# Altium schematic sheet Micro.SchDoc: Sample Sheet Title
size B; Date: MM/DD/YYYY; Author: Sample Author; Organization: ORGANIZATION; Address1: ADDRESS 1; Address2: ADDRESS 2; Address3: ADDRESS 3; Address4: ADDRESS 4; Revision: -; SheetNumber: 1; SheetTotal: 2; ENG_APP_DATE: --/--/--; DSN_APP_DATE: --/--/--; CHK_APP_DATE: --/--/--
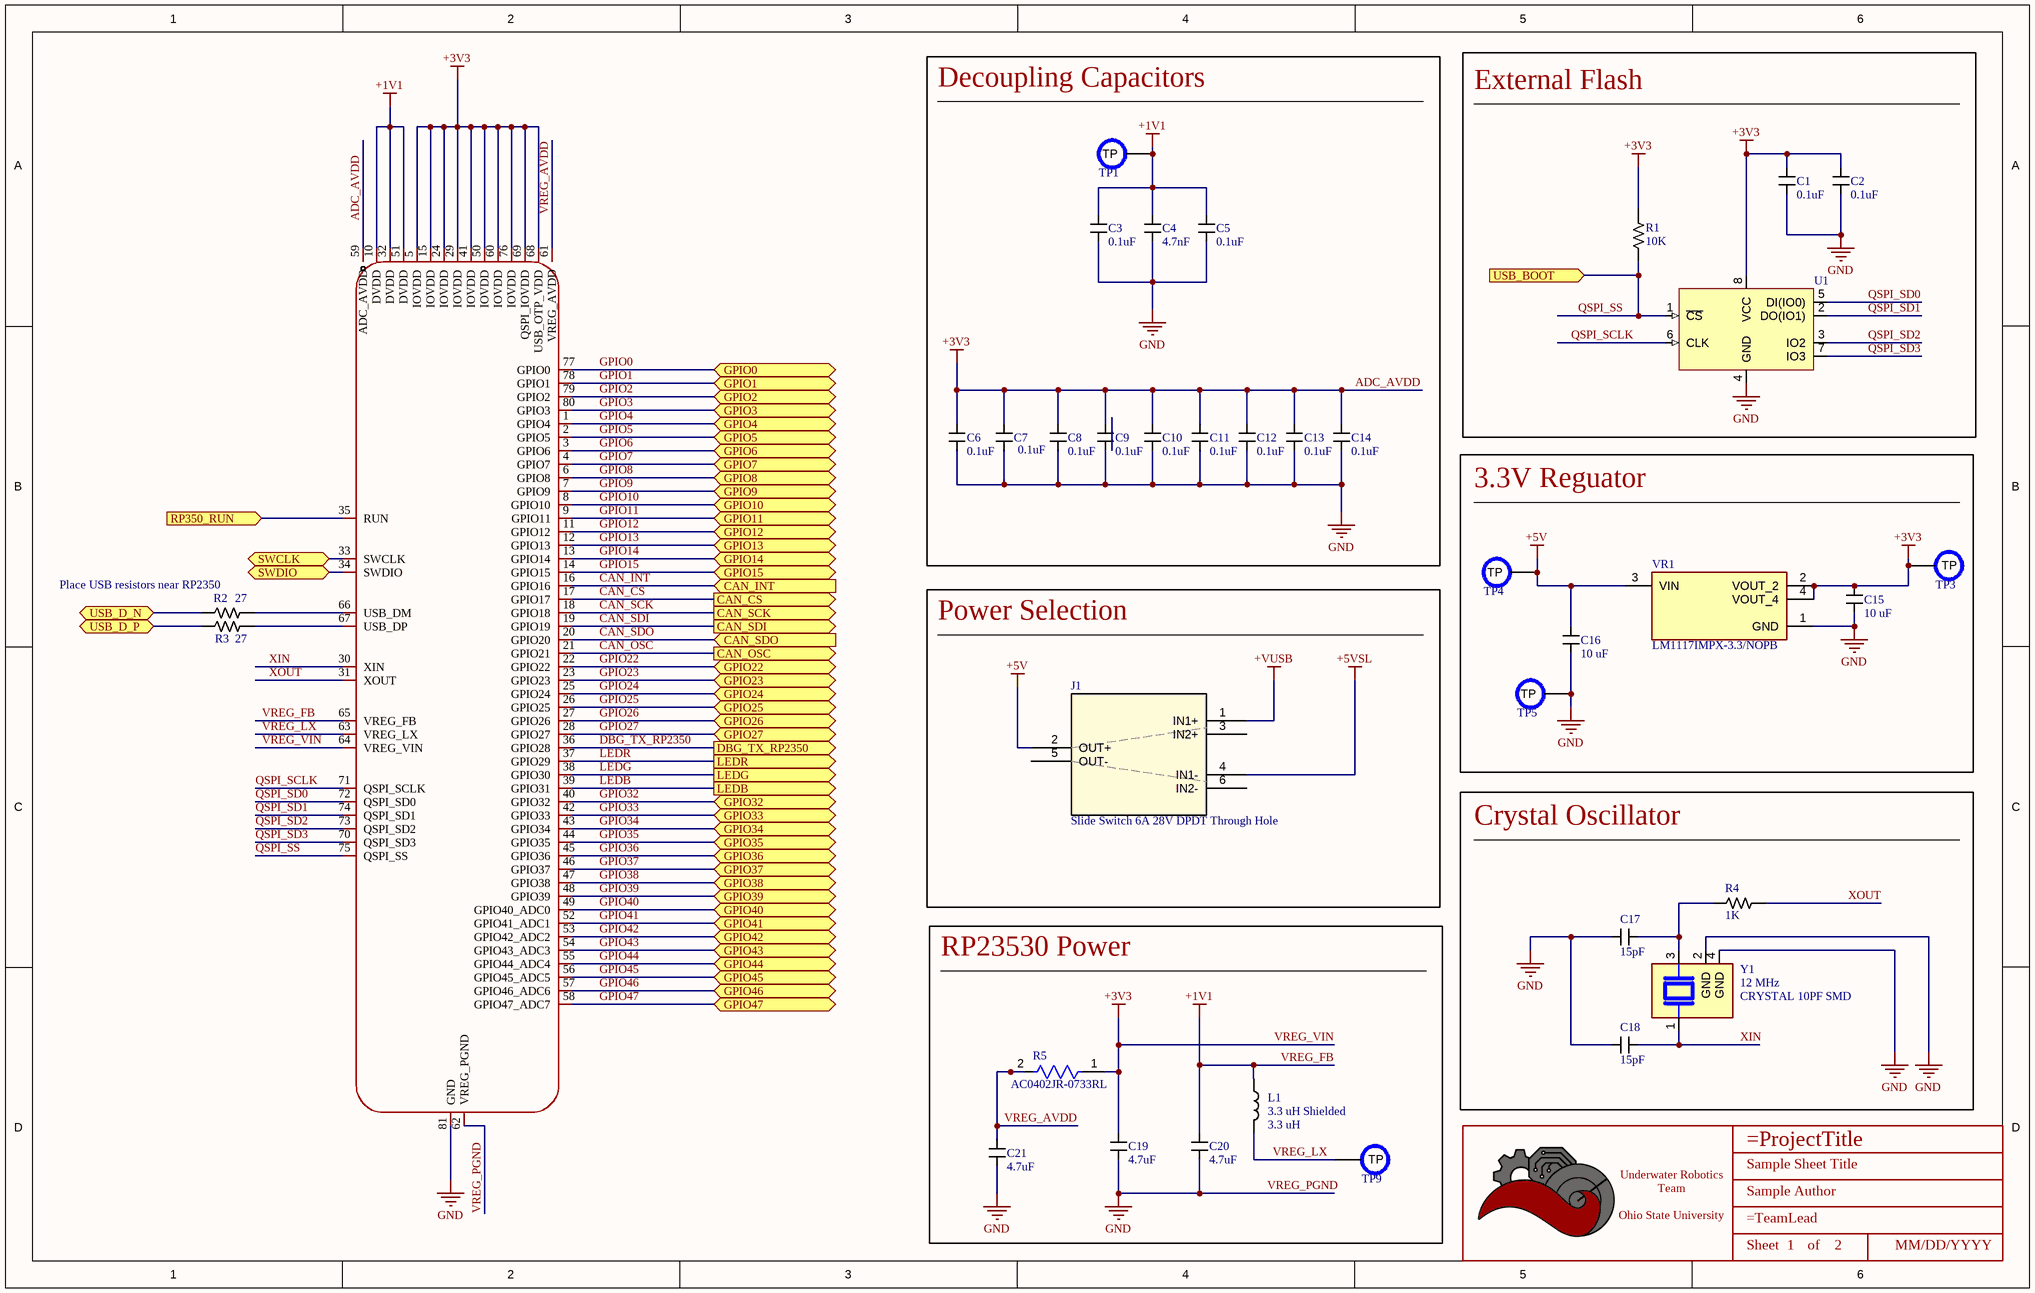
[diagram p0: Micro.SchDoc]

## Parts
*  Title_Block  [LOGO]  (value not drawn)  (graphical)
C1  value 0.1uF  [CAPACITOR_0402]  (hidden comment: 100nF Ceramic 25V)
C2  value 0.1uF  [CAPACITOR_0402]  (hidden comment: 100nF Ceramic 25V)
C3  value 0.1uF  [CAPACITOR_0402]  (hidden comment: 100nF Ceramic 25V)
C4  value 4.7nF  [CAPACITOR_0402]  (hidden comment: 4700pF Ceramic 25V)
C5  value 0.1uF  [CAPACITOR_0402]  (hidden comment: 100nF Ceramic 25V)
C6  value 0.1uF  [CAPACITOR_0402]  (hidden comment: 100nF Ceramic 25V)
C7  value 0.1uF  [CAPACITOR_0402]  (hidden comment: 100nF Ceramic 25V)
C8  value 0.1uF  [CAPACITOR_0402]  (hidden comment: 100nF Ceramic 25V)
C9  value 0.1uF  [CAPACITOR_0402]  (hidden comment: 100nF Ceramic 25V)
C10  value 0.1uF  [CAPACITOR_0402]  (hidden comment: 100nF Ceramic 25V)
C11  value 0.1uF  [CAPACITOR_0402]  (hidden comment: 100nF Ceramic 25V)
C12  value 0.1uF  [CAPACITOR_0402]  (hidden comment: 100nF Ceramic 25V)
C13  value 0.1uF  [CAPACITOR_0402]  (hidden comment: 100nF Ceramic 25V)
C14  value 0.1uF  [CAPACITOR_0402]  (hidden comment: 100nF Ceramic 25V)
C15  Value (uF): 10 uF  [CAPACITOR_0603]  (hidden comment: 10uF Ceramic 6.3V)
C16  Value (uF): 10 uF  [CAPACITOR_0603]  (hidden comment: 10uF Ceramic 6.3V)
C17  value 15pF  [CAPACITOR_0402]  (hidden comment: 15pF Ceramic 50V)
C18  value 15pF  [CAPACITOR_0402]  (hidden comment: 15pF Ceramic 50V)
C19  value 4.7uF  [CAPACITOR_0603]  (hidden comment: 4.7uF Ceramic 6.3V)
C20  value 4.7uF  [CAPACITOR_0603]  (hidden comment: 4.7uF Ceramic 6.3V)
C21  value 4.7uF  [CAPACITOR_0603]  (hidden comment: 4.7uF Ceramic 6.3V)
J1  Slide Switch 6A 28V DPDT Through Hole  [CONN_S3CQE2]
L1  3.3 uH Shielded  value 3.3 uH  [INDUCTOR_0806]
R1  Value  (Ohms): 10K  [RESISTOR_0603]  (hidden comment: 10k Ohm 0.5% 1/10W)
R2  Value  (Ohms): 27  [RESISTOR_0402]  (hidden comment: 27 Ohm 1% 1/16W)
R3  Value  (Ohms): 27  [RESISTOR_0402]  (hidden comment: 27 Ohm 1% 1/16W)
R4  Value  (Ohms): 1K  [RESISTOR_0402]  (hidden comment: 1k Ohm 1% 1/16W)
R5  AC0402JR-0733RL  [FP-AC0402-IPC_C]
TP1  PCB Test Point  [TESTPOINT_1.2MM]  (value not drawn)  (no BOM)
TP3  PCB Test Point  [TESTPOINT_1.2MM]  (value not drawn)  (no BOM)
TP4  PCB Test Point  [TESTPOINT_1.2MM]  (value not drawn)  (no BOM)
TP5  PCB Test Point  [TESTPOINT_1.2MM]  (value not drawn)  (no BOM)
TP9  PCB Test Point  [TESTPOINT_1.2MM]  (value not drawn)  (no BOM)
U1  W25Q128JVSIQ  [SOIC-8 W25QxJV]  (value not drawn)
U2  RP2350B  [QFN-80]  (value not drawn)
VR1  LM1117IMPX-3.3/NOPB  [SOT-223-4]
Y1  CRYSTAL 10PF SMD  value 12 MHz  [4-SMD, NO LEAD CRYSTAL 3.2x2.5mm]

## Blocks framed on the sheet
Decoupling Capacitors: C3-C14 TP1
External Flash: C1 C2 R1 U1
3.3V Reguator: C15 C16 TP3-TP5 VR1
Power Selection: J1
Crystal Oscillator: C17 C18 R4 Y1
RP23530 Power: C19-C21 L1 R5 TP9

## Ports
CAN_CS (out), CAN_INT (in), CAN_OSC (out), CAN_SCK (out), CAN_SDI (out), CAN_SDO (in), DBG_TX_RP2350 (out), GPIO0 (bidir), GPIO1 (bidir), GPIO2 (bidir), GPIO3 (bidir), GPIO4 (bidir), GPIO5 (bidir), GPIO6 (bidir), GPIO7 (bidir), GPIO8 (bidir), GPIO9 (bidir), GPIO10 (bidir), GPIO11 (bidir), GPIO12 (bidir), GPIO13 (bidir), GPIO14 (bidir), GPIO15 (bidir), GPIO22 (bidir), GPIO23 (bidir), GPIO24 (bidir), GPIO25 (bidir), GPIO26 (bidir), GPIO27 (bidir), GPIO32 (bidir), GPIO33 (bidir), GPIO34 (bidir), GPIO35 (bidir), GPIO36 (bidir), GPIO37 (bidir), GPIO38 (bidir), GPIO39 (bidir), GPIO40 (bidir), GPIO41 (bidir), GPIO42 (bidir), GPIO43 (bidir), GPIO44 (bidir), GPIO45 (bidir), GPIO46 (bidir), GPIO47 (bidir), LEDB (out), LEDG (out), LEDR (out), RP350_RUN (in), SWCLK (bidir), SWDIO (bidir), USB_BOOT (in), USB_D_N (bidir), USB_D_P (bidir)

## Nets
+5V: C16.1 J1.2(OUT+) TP4.TP VR1.3(VIN)
+5VSL: J1.4(IN1-)
+VUSB: J1.1(IN1+)
ADC_AVDD: C1.1 C2.1 C6.1 C7.1 C8.1 C9.1 C10.1 C11.1 C12.1 C13.1 C14.1 C15.1 C19.1 R1.1 R5.1 TP3.TP U1.8(VCC) U2.5(IOVDD) U2.15(IOVDD) U2.24(IOVDD) U2.29(IOVDD) U2.41(IOVDD) U2.50(IOVDD) U2.59(ADC_AVDD) U2.60(IOVDD) U2.64(VREG_VIN) U2.68(USB_OTP_VDD) U2.69(QSPI_IOVDD) U2.76(IOVDD) VR1.2(VOUT_2) VR1.4(VOUT_4)  [also labelled +3V3, VREG_VIN]
VREG_FB: C3.1 C4.1 C5.1 C20.2 L1.2 TP1.TP U2.10(DVDD) U2.32(DVDD) U2.51(DVDD) U2.65(VREG_FB)  [also labelled +1V1]
VREG_PGND: C1.2 C2.2 C3.2 C4.2 C5.2 C6.2 C7.2 C8.2 C9.2 C10.2 C11.2 C12.2 C13.2 C14.2 C15.2 C16.2 C17.2 C18.2 C19.2 C20.1 C21.2 TP5.TP U1.4(GND) U2.62(VREG_PGND) U2.81(GND) VR1.1(GND) Y1.2(GND) Y1.4(GND)  [also labelled GND]
CAN_CS: U2.17(GPIO17) ; port CAN_CS
CAN_INT: U2.16(GPIO16) ; port CAN_INT
CAN_OSC: U2.21(GPIO21) ; port CAN_OSC
CAN_SCK: U2.18(GPIO18) ; port CAN_SCK
CAN_SDI: U2.19(GPIO19) ; port CAN_SDI
CAN_SDO: U2.20(GPIO20) ; port CAN_SDO
DBG_TX_RP2350: U2.36(GPIO28) ; port DBG_TX_RP2350
GPIO0: U2.77(GPIO0) ; port GPIO0
GPIO1: U2.78(GPIO1) ; port GPIO1
GPIO2: U2.79(GPIO2) ; port GPIO2
GPIO3: U2.80(GPIO3) ; port GPIO3
GPIO4: U2.1(GPIO4) ; port GPIO4
GPIO5: U2.2(GPIO5) ; port GPIO5
GPIO6: U2.3(GPIO6) ; port GPIO6
GPIO7: U2.4(GPIO7) ; port GPIO7
GPIO8: U2.6(GPIO8) ; port GPIO8
GPIO9: U2.7(GPIO9) ; port GPIO9
GPIO10: U2.8(GPIO10) ; port GPIO10
GPIO11: U2.9(GPIO11) ; port GPIO11
GPIO12: U2.11(GPIO12) ; port GPIO12
GPIO13: U2.12(GPIO13) ; port GPIO13
GPIO14: U2.13(GPIO14) ; port GPIO14
GPIO15: U2.14(GPIO15) ; port GPIO15
GPIO22: U2.22(GPIO22) ; port GPIO22
GPIO23: U2.23(GPIO23) ; port GPIO23
GPIO24: U2.25(GPIO24) ; port GPIO24
GPIO25: U2.26(GPIO25) ; port GPIO25
GPIO26: U2.27(GPIO26) ; port GPIO26
GPIO27: U2.28(GPIO27) ; port GPIO27
GPIO32: U2.40(GPIO32) ; port GPIO32
GPIO33: U2.42(GPIO33) ; port GPIO33
GPIO34: U2.43(GPIO34) ; port GPIO34
GPIO35: U2.44(GPIO35) ; port GPIO35
GPIO36: U2.45(GPIO36) ; port GPIO36
GPIO37: U2.46(GPIO37) ; port GPIO37
GPIO38: U2.47(GPIO38) ; port GPIO38
GPIO39: U2.48(GPIO39) ; port GPIO39
GPIO40: U2.49(GPIO40_ADC0) ; port GPIO40
GPIO41: U2.52(GPIO41_ADC1) ; port GPIO41
GPIO42: U2.53(GPIO42_ADC2) ; port GPIO42
GPIO43: U2.54(GPIO43_ADC3) ; port GPIO43
GPIO44: U2.55(GPIO44_ADC4) ; port GPIO44
GPIO45: U2.56(GPIO45_ADC5) ; port GPIO45
GPIO46: U2.57(GPIO46_ADC6) ; port GPIO46
GPIO47: U2.58(GPIO47_ADC7) ; port GPIO47
LEDB: U2.39(GPIO31) ; port LEDB
LEDG: U2.38(GPIO30) ; port LEDG
LEDR: U2.37(GPIO29) ; port LEDR
QSPI_SCLK: U1.6(CLK) U2.71(QSPI_SCLK)
QSPI_SD0: U1.5(DI(IO0)) U2.72(QSPI_SD0)
QSPI_SD1: U1.2(DO(IO1)) U2.74(QSPI_SD1)
QSPI_SD2: U1.3(IO2) U2.73(QSPI_SD2)
QSPI_SD3: U1.7(IO3) U2.70(QSPI_SD3)
QSPI_SS: R1.2 U1.1(~{CS}) U2.75(QSPI_SS) ; port USB_BOOT
RP350_RUN: U2.35(RUN) ; port RP350_RUN
SWCLK: U2.33(SWCLK) ; port SWCLK
SWDIO: U2.34(SWDIO) ; port SWDIO
USB_D_N: R2.2 ; port USB_D_N
USB_D_P: R3.2 ; port USB_D_P
VREG_AVDD: C21.1 R5.2 U2.61(VREG_AVDD)
VREG_LX: L1.1 TP9.TP U2.63(VREG_LX)
XIN: C18.1 U2.30(XIN) Y1.1
XOUT: R4.1 U2.31(XOUT)
NetC17_1: C17.1 R4.2 Y1.3
NetR2_1: R2.1 U2.66(USB_DM)
NetR3_1: R3.1 U2.67(USB_DP)

Not connected (* = marked no-connect by the designer): J1 3(IN2+) 5(OUT-) 6(IN2-)

## Notes on the sheet
- Place USB resistors near RP2350
- Labels drawn without touching a wire or pin: \
- DWG. NO.
- REV.
- SHT.
- THIS DOCUMENT AND THE DATA DISCLOSED HEREIN OR HEREWITH IS THE PROPERTY OF ALTIUM LIMITED AND MAY BE FREELY DISTRIBUTED IN WHOLE. NO RIGHTS ARE RESERVED OR EXPRESS OR IMPLIED WARANTEE GIVEN.
- REVISION
- DESCRIPTION
- DATE
- APPROVED
- ENG:
- APPROVALS
- PROJECT
- DSN:
- CHK:
- REFERENCE DOCUMENTS
- PROJECT REVISION:
- TITLE
- DOCUMENT REVISION:
- DESIGN ITEM:
- BOM:
- FAB DWG:
- PCB DWG:
- ASSY DWG:
- SCALE:
- SIZE
- B
- CAGE CODE
- FILE NAME
- DWG NO.
- SHEET
- OF
- REV
- (in symbol Title_Block) Underwater Robotics Team / Ohio State University; Sheet; of

## Library data of the parts
* = Title_Block: UWRT Schematic Title Block Template / Created June 2021, Dylan Trainor
C1-C3 C5-C14 = CAPACITOR_0.1uF_0402: Cap 100nF 25V +/-10% / Ceramic 0402; Made By: Robert Pafford; Tolerance: +/- 10%; Voltage: 25V; Supplier 1: Future Electronics; Supplier Part Number 1: 7029569
C4 = CAPACITOR_0.0047uF_0402: 4700 pF +/-10% 25V Ceramic Capacitor X7R 0402; Made By: Robert Pafford; Tolerance: +/- 10%; Voltage: 25V; Supplier 1: Future Electronics; Supplier Part Number 1: 1909415
C15 C16 = CAPACITOR_10uF_0603: Cap 10uF 6.3V +/-20% / Ceramic 0603; Made By: Flip B; ComponentLink1Description: Digikey; ComponentLink1URL: https://www.digikey.com/en/products/detail/samsung-electro-mechanics/CL10A106MQ8NNNC/3886777; Supplier 1: Digi-Key; Supplier Part Number 1: 1276-1119-1-ND; Tolerance: +/- 20%; Voltage: 6.3V
C17 C18 = CAPACITOR_0.000015uF_0402: CAP CER 15PF 50V C0G/NP0 0402; Tolerance: +/- 5%; Made By: Robert Pafford; Voltage: 50V; Supplier 1: Newark; Supplier Part Number 1: 82AC9245
C19-C21 = CAPACITOR_4.7uF_0603: Cap 4.7uF 6.3V +/-10% / Ceramic 0603; Made By: Robert Pafford; Tolerance: +/- 10%; Voltage: 6.3V; Supplier 1: Digi-Key; Supplier Part Number 1: 1276-2087-1-ND
J1 = Slide DPDT Switch: SWITCH SLIDE DPDT 6A 28V Through Hole; Mfr_Name: C&K; Manufacturer_Part_Number: 1201M2S3CQE2; Copyright: Copyright (C) 2022 Ultra Librarian. All rights reserved.; RefDes: RefDes; Type: DEV; Supplier 1: Newark; Supplier Part Number 1: 36AH1005
L1 = INDUCTOR_3.3uH_0806: 3.3 µH Shielded Molded Inductor 2.1 A 140mOhm Max 0806 (2016 Metric); Manufacturer: Abracon LLC; Supplier 1: DigiKey; Supplier Part Number 1: 535-AOTA-B201610S3R3-101-TDKR-ND; Created By: John Ulm
R1 = RESISTOR_10K_0.5%_0603: RES 10k OHM 0.5% 1/10W 0603; Tolerance: +/- 0.5%; Made By: Robert Pafford; Wattage: 1/10W; Supplier: Digikey; Digikey Part Numer: CR0603-JW-104ELFTR-ND; Supplier 1: Digi-Key; Supplier Part Number 1: 749-1695-1-ND
R2 R3 = RESISTOR_27_0402: RES 27 OHM 1% 1/16W 0402; Tolerance: +/- 1%; Made By: Robert Pafford; Wattage: 1/16W; Supplier: Digikey; Digikey Part Numer: CR0603-JW-104ELFTR-ND; Supplier 1: Digi-Key; Supplier Part Number 1: YAG5278DKR-ND
R4 = RESISTOR_1K_0402: RES 1k OHM 1% 1/16W 0402; Tolerance: +/- 1%; Made By: Robert Pafford; Wattage: 1/16W; Supplier: Digikey; Digikey Part Numer: CR0603-JW-104ELFTR-ND; Supplier 1: Digi-Key; Supplier Part Number 1: 13-AC0402FR-131KLCT-ND
R5 = CMP-03412-045460-1: RES 33Ω ±5% 0.063W 0402; Resistance: 33R; Voltage Rating: 50V; Power Rating: 62.5mW; Temperature Coefficient: 100ppm/°C; Max Power Dissipation: 63mW; Width: 0.5mm; Max Operating Temperature: 155°C; Termination: SMD/SMT; Size Code: 0402; Lead Free: Lead Free; Series: AC; Case Code (Imperial): 0402; RoHS Compliant: Yes; Packaging: Tape and Reel; Features: Moisture Resistant; Case/Package: 0402; Height: 0.015inch; Length: 0.039inch; Number of Terminations: 2; Case Code (Metric): 1005; Tolerance: 5%; Min Operating Temperature: -55°C; Weight: 2.3E-05oz; Resistor Type: Thick Film
TP1 TP3-TP5 TP9 = TESTPOINT: Made By: Robert Pafford
U1 = W25Q128JVSIQ: IC FLASH 128MBIT SPI/QUAD 8SOIC; Made By: Robert Pafford; Supplier 1: Digi-Key; Supplier Part Number 1: W25Q128JVSIQ-ND; Size: 128M
U2 = RP2350B_C42415655: Manufacturer: Raspberry Pi(树莓派); Add into BOM: yes; Symbol: RP2350B_C42415655; Device: RP2350B_C42415655; LCSC Part Name: 微控制器; Supplier Part: C42415655; Manufacturer Part: RP2350B; Supplier Footprint: QFN-80-EP(10x10); JLCPCB Part Class: Extended Part; Datasheet: https://item.szlcsc.com/datasheet/RP2350B/44413055.html; Supplier: LCSC; Convert to PCB: yes
VR1 = LM1117IMPX-3.3/NOPB: 800-mA 15-V linear voltage regulator 4-SOT-223 -40 to 125; MF: Texas Instruments; Texas_Instruments-Purchase-URL: https://snapeda.com/shop?store=Texas+Instruments&id=410186; Price: None; Mouser-Purchase-URL: https://snapeda.com/shop?store=Mouser&id=410186; MP: LM1117IMPX-3.3/NOPB; Value: *; Availability: Good; Package: SOT-223-4 Texas Instruments; Arrow_Electronics-Purchase-URL: https://snapeda.com/shop?store=Arrow+Electronics&id=410186; SnapEDA_Link: https://www.snapeda.com/parts/LM1117IMPX-3.3/NOPB/Texas%20Instruments/view-part/410186/?ref=snap; DigiKey-Purchase-URL: https://snapeda.com/shop?store=DigiKey&id=410186
Y1 = CRYSTAL_12MHz_RP2350: 12 MHz ±30ppm Crystal 10pF 50 Ohms 4-SMD, No Lead; Supplier 1: DigiKey; Supplier Part Number 1: 535-ABM8-272-T3CT-ND; Created By: John Ulm